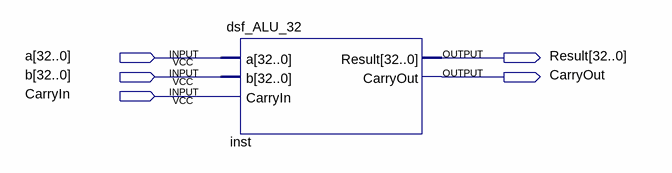
[diagram p0: schematic sheet]
// Quartus schematic dsf_ALU_32.bdf as structural Verilog: 1 symbols, 5 pins
module dsf_ALU_32 (
  input  [32:0] a,
  input  [32:0] b,
  input  CarryIn,
  output [32:0] Result,
  output CarryOut
);

  dsf_ALU_32 inst (.a(a), .b(b), .CarryIn(CarryIn), .Result(Result), .CarryOut(CarryOut));
endmodule
